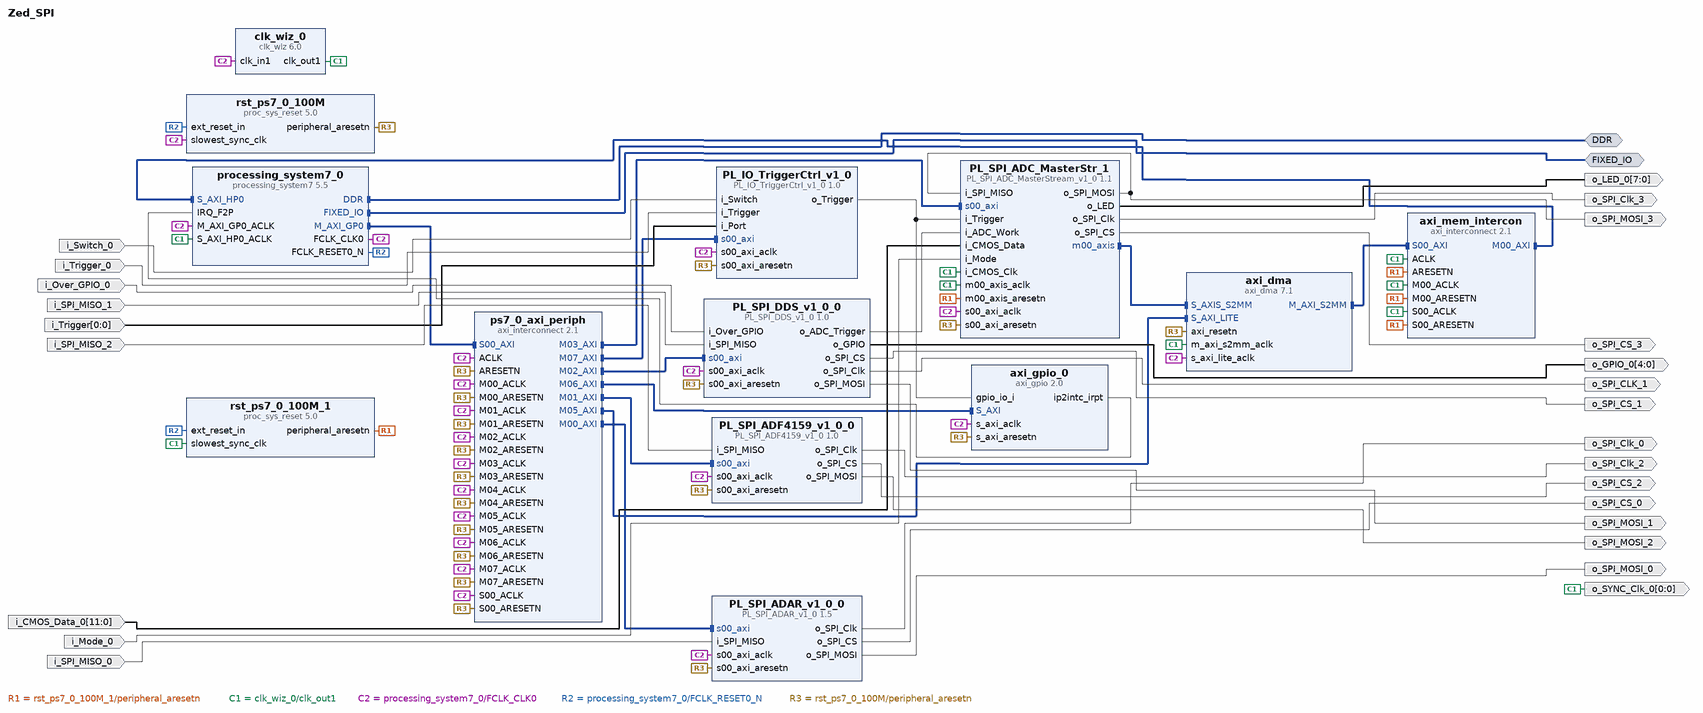
[diagram p0: block diagram of the top level]
# Vivado block design Zed_SPI, xc7z020clg484-1, Vivado 2021.2
create_bd_design Zed_SPI

create_bd_intf_port -mode Master -vlnv xilinx.com:interface:ddrx_rtl:1.0 DDR
create_bd_intf_port -mode Master -vlnv xilinx.com:display_processing_system7:fixedio_rtl:1.0 FIXED_IO
create_bd_port -dir I i_SPI_MISO_1
create_bd_port -dir O o_SPI_CS_1
create_bd_port -dir O -type clk o_SPI_CLK_1
create_bd_port -dir O o_SPI_MOSI_1
create_bd_port -dir O -from 7 -to 0 o_LED_0
create_bd_port -dir I i_Over_GPIO_0
create_bd_port -dir O -from 4 -to 0 o_GPIO_0
create_bd_port -dir O -type clk o_SPI_Clk_0
create_bd_port -dir O o_SPI_MOSI_0
create_bd_port -dir O o_SPI_CS_0
create_bd_port -dir I i_SPI_MISO_0
create_bd_port -dir O -type clk o_SPI_Clk_2
create_bd_port -dir O o_SPI_MOSI_2
create_bd_port -dir O o_SPI_CS_2
create_bd_port -dir I i_SPI_MISO_2
create_bd_port -dir O -type clk o_SPI_Clk_3
create_bd_port -dir O o_SPI_MOSI_3
create_bd_port -dir O o_SPI_CS_3
create_bd_port -dir O -from 0 -to 0 -type clk o_SYNC_Clk_0
create_bd_port -dir I -from 0 -to 0 i_Trigger
create_bd_port -dir I i_Mode_0
create_bd_port -dir I i_Switch_0
create_bd_port -dir I i_Trigger_0
create_bd_port -dir I -from 11 -to 0 i_CMOS_Data_0

create_bd_cell -type ip -vlnv xilinx.com:ip:processing_system7:5.5 processing_system7_0
set_property -dict [list \
  CONFIG.PCW_APU_PERIPHERAL_FREQMHZ 666.666667 \
  CONFIG.PCW_ENET0_ENET0_IO {MIO 16 .. 27} \
  CONFIG.PCW_ENET0_GRP_MDIO_ENABLE 1 \
  CONFIG.PCW_ENET0_GRP_MDIO_IO {MIO 52 .. 53} \
  CONFIG.PCW_ENET0_PERIPHERAL_ENABLE 1 \
  CONFIG.PCW_ENET0_RESET_ENABLE 0 \
  CONFIG.PCW_ENET_RESET_ENABLE 1 \
  CONFIG.PCW_ENET_RESET_SELECT {Share reset pin} \
  CONFIG.PCW_FPGA0_PERIPHERAL_FREQMHZ 100.000000 \
  CONFIG.PCW_FPGA1_PERIPHERAL_FREQMHZ 150.000000 \
  CONFIG.PCW_GPIO_MIO_GPIO_ENABLE 1 \
  CONFIG.PCW_GPIO_MIO_GPIO_IO MIO \
  CONFIG.PCW_I2C_RESET_ENABLE 1 \
  CONFIG.PCW_IRQ_F2P_INTR 1 \
  CONFIG.PCW_PERIPHERAL_BOARD_PRESET part0 \
  CONFIG.PCW_PRESET_BANK1_VOLTAGE {LVCMOS 1.8V} \
  CONFIG.PCW_QSPI_GRP_SINGLE_SS_ENABLE 1 \
  CONFIG.PCW_QSPI_GRP_SINGLE_SS_IO {MIO 1 .. 6} \
  CONFIG.PCW_QSPI_PERIPHERAL_ENABLE 1 \
  CONFIG.PCW_QSPI_QSPI_IO {MIO 1 .. 6} \
  CONFIG.PCW_SD0_GRP_CD_ENABLE 1 \
  CONFIG.PCW_SD0_GRP_CD_IO {MIO 47} \
  CONFIG.PCW_SD0_GRP_WP_ENABLE 1 \
  CONFIG.PCW_SD0_GRP_WP_IO {MIO 46} \
  CONFIG.PCW_SD0_PERIPHERAL_ENABLE 1 \
  CONFIG.PCW_SD0_SD0_IO {MIO 40 .. 45} \
  CONFIG.PCW_SDIO_PERIPHERAL_FREQMHZ 50 \
  CONFIG.PCW_SINGLE_QSPI_DATA_MODE x4 \
  CONFIG.PCW_TTC0_PERIPHERAL_ENABLE 1 \
  CONFIG.PCW_TTC0_TTC0_IO EMIO \
  CONFIG.PCW_UART1_PERIPHERAL_ENABLE 1 \
  CONFIG.PCW_UART1_UART1_IO {MIO 48 .. 49} \
  CONFIG.PCW_UART_PERIPHERAL_FREQMHZ 50 \
  CONFIG.PCW_UIPARAM_DDR_FREQ_MHZ 533.333313 \
  CONFIG.PCW_UIPARAM_DDR_PARTNO {MT41J128M16 HA-15E} \
  CONFIG.PCW_USB0_PERIPHERAL_ENABLE 1 \
  CONFIG.PCW_USB0_RESET_ENABLE 0 \
  CONFIG.PCW_USB0_USB0_IO {MIO 28 .. 39} \
  CONFIG.PCW_USB_RESET_ENABLE 1 \
  CONFIG.PCW_USB_RESET_SELECT {Share reset pin} \
  CONFIG.PCW_USE_FABRIC_INTERRUPT 1 \
  CONFIG.PCW_USE_S_AXI_HP0 1 \
  CONFIG.preset ZedBoard \
] [get_bd_cells processing_system7_0]
# 516 more settings of processing_system7_0 are not shown: defaults, MIO pin electricals, DDR timing, and values the tool derives
create_bd_cell -type ip -vlnv xilinx.com:ip:axi_interconnect:2.1 ps7_0_axi_periph
set_property -dict {CONFIG.NUM_MI 8 CONFIG.NUM_SI 1} [get_bd_cells ps7_0_axi_periph]
create_bd_cell -type ip -vlnv xilinx.com:ip:proc_sys_reset:5.0 rst_ps7_0_100M
create_bd_cell -type ip -vlnv xilinx.com:ip:proc_sys_reset:5.0 rst_ps7_0_100M_1
create_bd_cell -type ip -vlnv xilinx.com:ip:axi_dma:7.1 axi_dma
set_property -dict [list \
  CONFIG.c_include_mm2s 0 \
  CONFIG.c_include_s2mm_dre 1 \
  CONFIG.c_include_sg 0 \
  CONFIG.c_s2mm_burst_size 16 \
  CONFIG.c_sg_length_width 25 \
] [get_bd_cells axi_dma]
create_bd_cell -type ip -vlnv xilinx.com:ip:axi_interconnect:2.1 axi_mem_intercon
set_property -dict {CONFIG.NUM_MI 1} [get_bd_cells axi_mem_intercon]
create_bd_cell -type ip -vlnv xilinx.com:ip:axi_gpio:2.0 axi_gpio_0
set_property -dict {CONFIG.C_ALL_INPUTS 1 CONFIG.C_GPIO_WIDTH 1 CONFIG.C_INTERRUPT_PRESENT 1} [get_bd_cells axi_gpio_0]
create_bd_cell -type ip -vlnv user.org:user:PL_IO_TriggerCtrl_v1_0:1.0 PL_IO_TriggerCtrl_v1_0
create_bd_cell -type ip -vlnv xilinx.com:ip:clk_wiz:6.0 clk_wiz_0
set_property -dict [list \
  CONFIG.CLKOUT1_JITTER 110.209 \
  CONFIG.CLKOUT1_PHASE_ERROR 98.575 \
  CONFIG.CLKOUT1_REQUESTED_OUT_FREQ 250 \
  CONFIG.MMCM_CLKFBOUT_MULT_F 10.000 \
  CONFIG.MMCM_CLKOUT0_DIVIDE_F 4.000 \
  CONFIG.MMCM_DIVCLK_DIVIDE 1 \
  CONFIG.USE_LOCKED false \
  CONFIG.USE_RESET false \
] [get_bd_cells clk_wiz_0]
create_bd_cell -type ip -vlnv xilinx.com:user:PL_SPI_ADAR_v1_0:1.5 PL_SPI_ADAR_v1_0_0
create_bd_cell -type ip -vlnv xilinx.com:user:PL_SPI_ADF4159_v1_0:1.0 PL_SPI_ADF4159_v1_0_0
create_bd_cell -type ip -vlnv xilinx.com:user:PL_SPI_DDS_v1_0:1.0 PL_SPI_DDS_v1_0_0
create_bd_cell -type ip -vlnv user.org:user:PL_SPI_ADC_MasterStream_v1_0:1.1 PL_SPI_ADC_MasterStr_1

# ---- connections ----

connect_bd_intf_net [get_bd_intf_pins axi_dma/S_AXIS_S2MM] [get_bd_intf_pins PL_SPI_ADC_MasterStr_1/m00_axis]
connect_bd_intf_net [get_bd_intf_pins axi_dma/M_AXI_S2MM] [get_bd_intf_pins axi_mem_intercon/S00_AXI]
connect_bd_intf_net [get_bd_intf_pins axi_mem_intercon/M00_AXI] [get_bd_intf_pins processing_system7_0/S_AXI_HP0]
connect_bd_intf_net [get_bd_intf_ports DDR] [get_bd_intf_pins processing_system7_0/DDR]
connect_bd_intf_net [get_bd_intf_ports FIXED_IO] [get_bd_intf_pins processing_system7_0/FIXED_IO]
connect_bd_intf_net [get_bd_intf_pins processing_system7_0/M_AXI_GP0] [get_bd_intf_pins ps7_0_axi_periph/S00_AXI]
connect_bd_intf_net [get_bd_intf_pins ps7_0_axi_periph/M00_AXI] [get_bd_intf_pins PL_SPI_ADAR_v1_0_0/s00_axi]
connect_bd_intf_net [get_bd_intf_pins ps7_0_axi_periph/M01_AXI] [get_bd_intf_pins PL_SPI_ADF4159_v1_0_0/s00_axi]
connect_bd_intf_net [get_bd_intf_pins ps7_0_axi_periph/M02_AXI] [get_bd_intf_pins PL_SPI_DDS_v1_0_0/s00_axi]
connect_bd_intf_net [get_bd_intf_pins ps7_0_axi_periph/M03_AXI] [get_bd_intf_pins PL_SPI_ADC_MasterStr_1/s00_axi]
connect_bd_intf_net [get_bd_intf_pins ps7_0_axi_periph/M05_AXI] [get_bd_intf_pins axi_dma/S_AXI_LITE]
connect_bd_intf_net [get_bd_intf_pins ps7_0_axi_periph/M06_AXI] [get_bd_intf_pins axi_gpio_0/S_AXI]
connect_bd_intf_net [get_bd_intf_pins ps7_0_axi_periph/M07_AXI] [get_bd_intf_pins PL_IO_TriggerCtrl_v1_0/s00_axi]
connect_bd_net -net M00_ARESETN_1 [get_bd_pins rst_ps7_0_100M_1/peripheral_aresetn] \
  [get_bd_pins axi_mem_intercon/S00_ARESETN] [get_bd_pins axi_mem_intercon/M00_ARESETN] \
  [get_bd_pins axi_mem_intercon/ARESETN] [get_bd_pins PL_SPI_ADC_MasterStr_1/m00_axis_aresetn]
connect_bd_net [get_bd_pins PL_IO_TriggerCtrl_v1_0/o_Trigger] [get_bd_pins axi_gpio_0/gpio_io_i] [get_bd_pins PL_SPI_ADC_MasterStr_1/i_Trigger]
connect_bd_net [get_bd_pins PL_SPI_ADAR_v1_0_0/o_SPI_CS] [get_bd_ports o_SPI_CS_0]
connect_bd_net [get_bd_pins PL_SPI_ADAR_v1_0_0/o_SPI_Clk] [get_bd_ports o_SPI_Clk_0]
connect_bd_net [get_bd_pins PL_SPI_ADAR_v1_0_0/o_SPI_MOSI] [get_bd_ports o_SPI_MOSI_0]
connect_bd_net -net PL_SPI_ADC_MasterStr_0_o_SPI_MOSI [get_bd_pins PL_SPI_ADC_MasterStr_1/o_SPI_MOSI] \
  [get_bd_ports o_SPI_MOSI_3] [get_bd_pins PL_SPI_ADC_MasterStr_1/i_SPI_MISO]
connect_bd_net [get_bd_pins PL_SPI_ADC_MasterStr_1/o_LED] [get_bd_ports o_LED_0]
connect_bd_net [get_bd_pins PL_SPI_ADC_MasterStr_1/o_SPI_CS] [get_bd_ports o_SPI_CS_3]
connect_bd_net [get_bd_pins PL_SPI_ADC_MasterStr_1/o_SPI_Clk] [get_bd_ports o_SPI_Clk_3]
connect_bd_net [get_bd_pins PL_SPI_ADF4159_v1_0_0/o_SPI_CS] [get_bd_ports o_SPI_CS_2]
connect_bd_net [get_bd_pins PL_SPI_ADF4159_v1_0_0/o_SPI_Clk] [get_bd_ports o_SPI_Clk_2]
connect_bd_net [get_bd_pins PL_SPI_ADF4159_v1_0_0/o_SPI_MOSI] [get_bd_ports o_SPI_MOSI_2]
connect_bd_net [get_bd_pins PL_SPI_DDS_v1_0_0/o_ADC_Trigger] [get_bd_pins PL_SPI_ADC_MasterStr_1/i_ADC_Work]
connect_bd_net [get_bd_pins PL_SPI_DDS_v1_0_0/o_GPIO] [get_bd_ports o_GPIO_0]
connect_bd_net [get_bd_pins PL_SPI_DDS_v1_0_0/o_SPI_CS] [get_bd_ports o_SPI_CS_1]
connect_bd_net [get_bd_pins PL_SPI_DDS_v1_0_0/o_SPI_Clk] [get_bd_ports o_SPI_CLK_1]
connect_bd_net [get_bd_pins PL_SPI_DDS_v1_0_0/o_SPI_MOSI] [get_bd_ports o_SPI_MOSI_1]
connect_bd_net [get_bd_pins axi_gpio_0/ip2intc_irpt] [get_bd_pins processing_system7_0/IRQ_F2P]
connect_bd_net -net clk_wiz_1_clk_out2 [get_bd_pins clk_wiz_0/clk_out1] \
  [get_bd_pins rst_ps7_0_100M_1/slowest_sync_clk] [get_bd_pins processing_system7_0/S_AXI_HP0_ACLK] \
  [get_bd_pins axi_dma/m_axi_s2mm_aclk] [get_bd_pins axi_mem_intercon/S00_ACLK] [get_bd_pins axi_mem_intercon/M00_ACLK] \
  [get_bd_pins axi_mem_intercon/ACLK] [get_bd_ports o_SYNC_Clk_0] [get_bd_pins PL_SPI_ADC_MasterStr_1/i_CMOS_Clk] \
  [get_bd_pins PL_SPI_ADC_MasterStr_1/m00_axis_aclk]
connect_bd_net -net i_CMOS_Data_0_1 [get_bd_ports i_CMOS_Data_0] [get_bd_pins PL_SPI_ADC_MasterStr_1/i_CMOS_Data]
connect_bd_net -net i_Mode_0_1 [get_bd_ports i_Mode_0] [get_bd_pins PL_SPI_ADC_MasterStr_1/i_Mode]
connect_bd_net -net i_Over_GPIO_0_1 [get_bd_ports i_Over_GPIO_0] [get_bd_pins PL_SPI_DDS_v1_0_0/i_Over_GPIO]
connect_bd_net -net i_SPI_MISO_0_1 [get_bd_ports i_SPI_MISO_0] [get_bd_pins PL_SPI_ADAR_v1_0_0/i_SPI_MISO]
connect_bd_net -net i_SPI_MISO_1_1 [get_bd_ports i_SPI_MISO_1] [get_bd_pins PL_SPI_DDS_v1_0_0/i_SPI_MISO]
connect_bd_net -net i_SPI_MISO_2_1 [get_bd_ports i_SPI_MISO_2] [get_bd_pins PL_SPI_ADF4159_v1_0_0/i_SPI_MISO]
connect_bd_net -net i_Switch_0_1 [get_bd_ports i_Switch_0] [get_bd_pins PL_IO_TriggerCtrl_v1_0/i_Switch]
connect_bd_net -net i_Trigger_0_1 [get_bd_ports i_Trigger_0] [get_bd_pins PL_IO_TriggerCtrl_v1_0/i_Trigger]
connect_bd_net [get_bd_ports i_Trigger] [get_bd_pins PL_IO_TriggerCtrl_v1_0/i_Port]
connect_bd_net [get_bd_pins processing_system7_0/FCLK_CLK0] \
  [get_bd_pins ps7_0_axi_periph/M04_ACLK] [get_bd_pins ps7_0_axi_periph/M03_ACLK] [get_bd_pins ps7_0_axi_periph/M02_ACLK] \
  [get_bd_pins ps7_0_axi_periph/M01_ACLK] [get_bd_pins ps7_0_axi_periph/M00_ACLK] [get_bd_pins ps7_0_axi_periph/S00_ACLK] \
  [get_bd_pins ps7_0_axi_periph/ACLK] [get_bd_pins rst_ps7_0_100M/slowest_sync_clk] \
  [get_bd_pins processing_system7_0/M_AXI_GP0_ACLK] [get_bd_pins axi_dma/s_axi_lite_aclk] \
  [get_bd_pins ps7_0_axi_periph/M05_ACLK] [get_bd_pins axi_gpio_0/s_axi_aclk] [get_bd_pins ps7_0_axi_periph/M06_ACLK] \
  [get_bd_pins PL_IO_TriggerCtrl_v1_0/s00_axi_aclk] [get_bd_pins ps7_0_axi_periph/M07_ACLK] [get_bd_pins clk_wiz_0/clk_in1] \
  [get_bd_pins PL_SPI_ADAR_v1_0_0/s00_axi_aclk] [get_bd_pins PL_SPI_ADF4159_v1_0_0/s00_axi_aclk] \
  [get_bd_pins PL_SPI_DDS_v1_0_0/s00_axi_aclk] [get_bd_pins PL_SPI_ADC_MasterStr_1/s00_axi_aclk]
connect_bd_net [get_bd_pins processing_system7_0/FCLK_RESET0_N] [get_bd_pins rst_ps7_0_100M/ext_reset_in] [get_bd_pins rst_ps7_0_100M_1/ext_reset_in]
connect_bd_net [get_bd_pins rst_ps7_0_100M/peripheral_aresetn] \
  [get_bd_pins ps7_0_axi_periph/ARESETN] [get_bd_pins ps7_0_axi_periph/S00_ARESETN] \
  [get_bd_pins ps7_0_axi_periph/M00_ARESETN] [get_bd_pins ps7_0_axi_periph/M01_ARESETN] \
  [get_bd_pins ps7_0_axi_periph/M02_ARESETN] [get_bd_pins ps7_0_axi_periph/M03_ARESETN] \
  [get_bd_pins ps7_0_axi_periph/M04_ARESETN] [get_bd_pins axi_dma/axi_resetn] [get_bd_pins ps7_0_axi_periph/M05_ARESETN] \
  [get_bd_pins axi_gpio_0/s_axi_aresetn] [get_bd_pins ps7_0_axi_periph/M06_ARESETN] \
  [get_bd_pins PL_IO_TriggerCtrl_v1_0/s00_axi_aresetn] [get_bd_pins ps7_0_axi_periph/M07_ARESETN] \
  [get_bd_pins PL_SPI_ADAR_v1_0_0/s00_axi_aresetn] [get_bd_pins PL_SPI_ADF4159_v1_0_0/s00_axi_aresetn] \
  [get_bd_pins PL_SPI_DDS_v1_0_0/s00_axi_aresetn] [get_bd_pins PL_SPI_ADC_MasterStr_1/s00_axi_aresetn]

# ---- address map ----
assign_bd_address -offset 0x00000000 -range 512M -target_address_space [get_bd_addr_spaces axi_dma/Data_S2MM] [get_bd_addr_segs processing_system7_0/S_AXI_HP0/HP0_DDR_LOWOCM]
assign_bd_address -offset 0x40400000 -range 64K -target_address_space [get_bd_addr_spaces processing_system7_0/Data] [get_bd_addr_segs axi_dma/S_AXI_LITE/Reg]
assign_bd_address -offset 0x41200000 -range 64K -target_address_space [get_bd_addr_spaces processing_system7_0/Data] [get_bd_addr_segs axi_gpio_0/S_AXI/Reg]
assign_bd_address -offset 0x43C10000 -range 64K -target_address_space [get_bd_addr_spaces processing_system7_0/Data] [get_bd_addr_segs PL_SPI_ADAR_v1_0_0/s00_axi/reg0]
assign_bd_address -offset 0x43C20000 -range 64K -target_address_space [get_bd_addr_spaces processing_system7_0/Data] [get_bd_addr_segs PL_SPI_ADC_MasterStr_1/s00_axi/reg0]
assign_bd_address -offset 0x43C30000 -range 64K -target_address_space [get_bd_addr_spaces processing_system7_0/Data] [get_bd_addr_segs PL_SPI_ADF4159_v1_0_0/s00_axi/reg0]
assign_bd_address -offset 0x43C40000 -range 64K -target_address_space [get_bd_addr_spaces processing_system7_0/Data] [get_bd_addr_segs PL_SPI_DDS_v1_0_0/s00_axi/reg0]
assign_bd_address -offset 0x43C50000 -range 64K -target_address_space [get_bd_addr_spaces processing_system7_0/Data] [get_bd_addr_segs PL_IO_TriggerCtrl_v1_0/s00_axi/reg0]

validate_bd_design
save_bd_design
